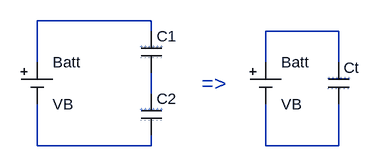
[diagram p0: schematic Series Network.asc]
Series Network.asc, the LTspice schematic file:
Version 4
SHEET 1 880 680
WIRE 160 64 -16 64
WIRE 160 80 160 64
WIRE 448 80 336 80
WIRE -16 128 -16 64
WIRE 336 128 336 80
WIRE 448 128 448 80
WIRE 160 176 160 144
WIRE -16 256 -16 192
WIRE 160 256 160 240
WIRE 160 256 -16 256
WIRE 336 256 336 192
WIRE 448 256 448 192
WIRE 448 256 336 256
SYMBOL Misc\\cell -16 128 R0
SYMATTR InstName Batt
SYMATTR Value VB
SYMBOL cap 432 128 R0
SYMATTR InstName Ct
SYMATTR Value ""
SYMBOL Misc\\cell 336 128 R0
SYMATTR InstName Batt
SYMATTR Value VB
SYMBOL cap 144 80 R0
SYMATTR InstName C1
SYMATTR Value ""
SYMBOL cap 144 176 R0
SYMATTR InstName C2
SYMATTR Value ""
TEXT 256 160 Center 3 ;=>
TEXT 160 104 Center 0 ;++++++
TEXT 160 120 Center 0 ;- - - - - -
TEXT 160 200 Center 0 ;++++++
TEXT 160 216 Center 0 ;- - - - - -
TEXT 448 152 Center 0 ;++++++
TEXT 448 168 Center 0 ;- - - - - -

The netlist it stands for:
* Series Network.asc
V§Batt N001 N004 VB
Ct N002 N005
V§Batt N002 N005 VB
C1 N001 N003
C2 N003 N004
* =>
* ++++++
* - - - - - -
* ++++++
* - - - - - -
* ++++++
* - - - - - -
.backanno
.end